# Altium schematic sheet 03_LEDs_0_4.SchDoc
size A
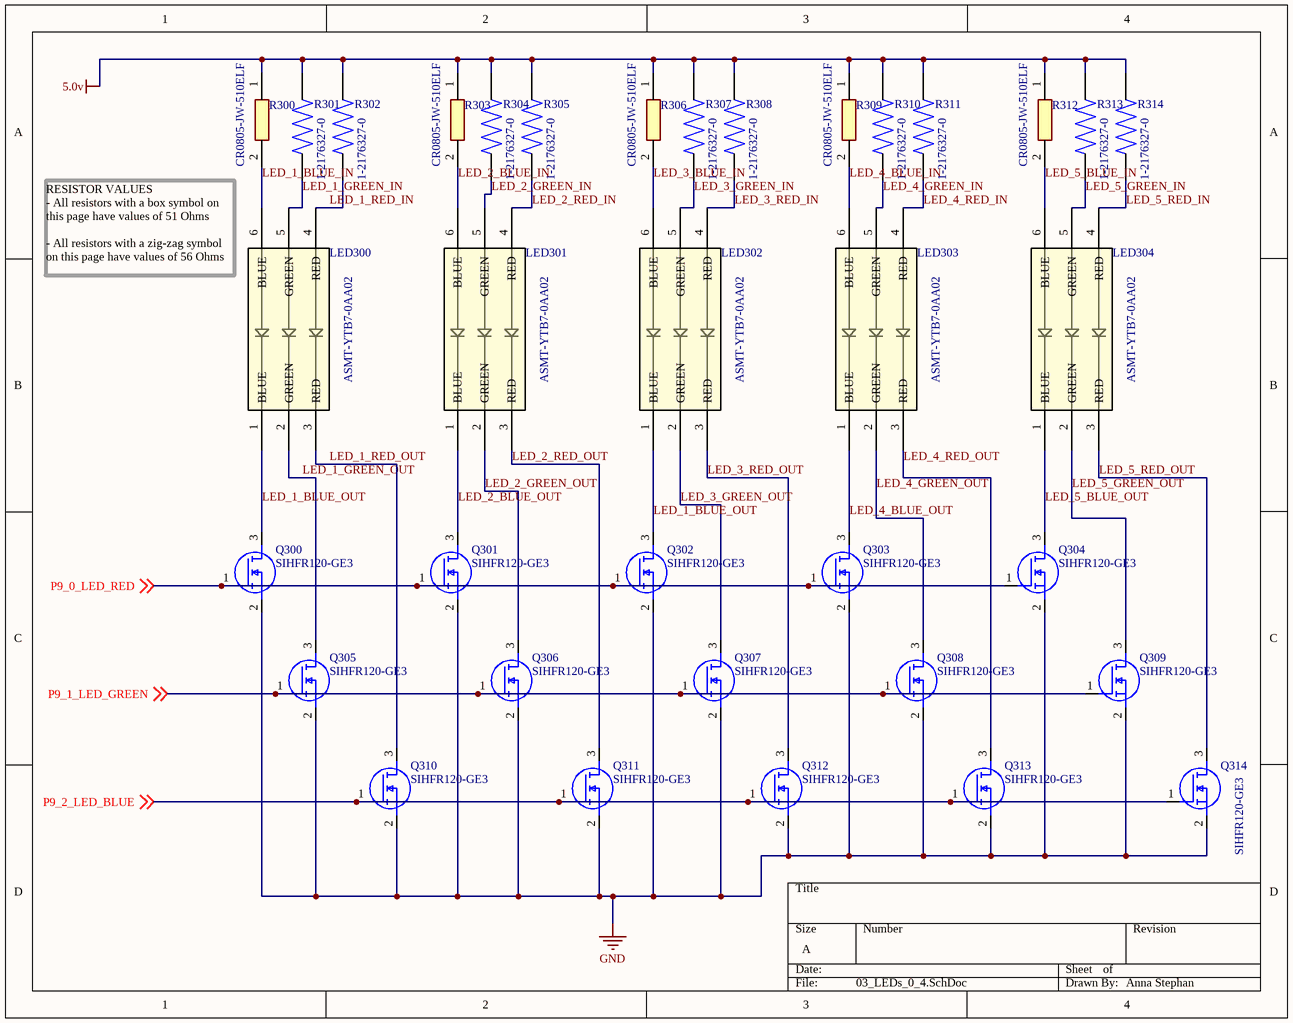
[diagram p0: 03_LEDs_0_4.SchDoc]

## Parts
LED300  ASMT-YTB7-0AA02  [LED_ASMT-YTD7-0AA02]
LED301  ASMT-YTB7-0AA02  [LED_ASMT-YTD7-0AA02]
LED302  ASMT-YTB7-0AA02  [LED_ASMT-YTD7-0AA02]
LED303  ASMT-YTB7-0AA02  [LED_ASMT-YTD7-0AA02]
LED304  ASMT-YTB7-0AA02  [LED_ASMT-YTD7-0AA02]
Q300  SIHFR120-GE3  [SIHFR120GE3]
Q301  SIHFR120-GE3  [SIHFR120GE3]
Q302  SIHFR120-GE3  [SIHFR120GE3]
Q303  SIHFR120-GE3  [SIHFR120GE3]
Q304  SIHFR120-GE3  [SIHFR120GE3]
Q305  SIHFR120-GE3  [SIHFR120GE3]
Q306  SIHFR120-GE3  [SIHFR120GE3]
Q307  SIHFR120-GE3  [SIHFR120GE3]
Q308  SIHFR120-GE3  [SIHFR120GE3]
Q309  SIHFR120-GE3  [SIHFR120GE3]
Q310  SIHFR120-GE3  [SIHFR120GE3]
Q311  SIHFR120-GE3  [SIHFR120GE3]
Q312  SIHFR120-GE3  [SIHFR120GE3]
Q313  SIHFR120-GE3  [SIHFR120GE3]
Q314  SIHFR120-GE3  [SIHFR120GE3]
R300  CR0805-JW-510ELF  [RESC2012X60N]
R301  1-2176327-0  [RESC2012X65N]
R302  1-2176327-0  [RESC2012X65N]
R303  CR0805-JW-510ELF  [RESC2012X60N]
R304  1-2176327-0  [RESC2012X65N]
R305  1-2176327-0  [RESC2012X65N]
R306  CR0805-JW-510ELF  [RESC2012X60N]
R307  1-2176327-0  [RESC2012X65N]
R308  1-2176327-0  [RESC2012X65N]
R309  CR0805-JW-510ELF  [RESC2012X60N]
R310  1-2176327-0  [RESC2012X65N]
R311  1-2176327-0  [RESC2012X65N]
R312  CR0805-JW-510ELF  [RESC2012X60N]
R313  1-2176327-0  [RESC2012X65N]
R314  1-2176327-0  [RESC2012X65N]

## Nets
5.0v: R300.1 R301.2 R302.2 R303.1 R304.2 R305.2 R306.1 R307.2 R308.2 R309.1 R310.2 R311.2 R312.1 R313.2 R314.2
GND: Q300.2(S) Q301.2(S) Q302.2(S) Q303.2(S) Q304.2(S) Q305.2(S) Q306.2(S) Q307.2(S) Q308.2(S) Q309.2(S) Q310.2(S) Q311.2(S) Q312.2(S) Q313.2(S) Q314.2(S)
LED_1_BLUE_IN: LED300.6(BLUE) R300.2
LED_1_BLUE_OUT: LED300.1(BLUE) LED302.1(BLUE) Q300.3(D) Q302.3(D)
LED_1_GREEN_IN: LED300.5(GREEN) R301.1
LED_1_GREEN_OUT: LED300.2(GREEN) Q305.3(D)
LED_1_RED_IN: LED300.4(RED) R302.1
LED_1_RED_OUT: LED300.3(RED) Q310.3(D)
LED_2_BLUE_IN: LED301.6(BLUE) R303.2
LED_2_BLUE_OUT: LED301.1(BLUE) Q301.3(D)
LED_2_GREEN_IN: LED301.5(GREEN) R304.1
LED_2_GREEN_OUT: LED301.2(GREEN) Q306.3(D)
LED_2_RED_IN: LED301.4(RED) R305.1
LED_2_RED_OUT: LED301.3(RED) Q311.3(D)
LED_3_BLUE_IN: LED302.6(BLUE) R306.2
LED_3_GREEN_IN: LED302.5(GREEN) R307.1
LED_3_GREEN_OUT: LED302.2(GREEN) Q307.3(D)
LED_3_RED_IN: LED302.4(RED) R308.1
LED_3_RED_OUT: LED302.3(RED) Q312.3(D)
LED_4_BLUE_IN: LED303.6(BLUE) R309.2
LED_4_BLUE_OUT: LED303.1(BLUE) Q303.3(D)
LED_4_GREEN_IN: LED303.5(GREEN) R310.1
LED_4_GREEN_OUT: LED303.2(GREEN) Q308.3(D)
LED_4_RED_IN: LED303.4(RED) R311.1
LED_4_RED_OUT: LED303.3(RED) Q313.3(D)
LED_5_BLUE_IN: LED304.6(BLUE) R312.2
LED_5_BLUE_OUT: LED304.1(BLUE) Q304.3(D)
LED_5_GREEN_IN: LED304.5(GREEN) R313.1
LED_5_GREEN_OUT: LED304.2(GREEN) Q309.3(D)
LED_5_RED_IN: LED304.4(RED) R314.1
LED_5_RED_OUT: LED304.3(RED) Q314.3(D)
P9_0_LED_RED: Q300.1(G) Q301.1(G) Q302.1(G) Q303.1(G) Q304.1(G) ; off-sheet P9_0_LED_RED
P9_1_LED_GREEN: Q305.1(G) Q306.1(G) Q307.1(G) Q308.1(G) Q309.1(G) ; off-sheet P9_1_LED_GREEN
P9_2_LED_BLUE: Q310.1(G) Q311.1(G) Q312.1(G) Q313.1(G) Q314.1(G) ; off-sheet P9_2_LED_BLUE

## Notes on the sheet
- (near LED300) RESISTOR VALUES
  - All resistors with a box symbol on this page have values of 51 Ohms
  - All resistors with a zig-zag symbol on this page have values of 56 Ohms
- Anna Stephan

## Library data of the parts
LED300-LED304 = ASMT-YTB7-0AA02: No Description Available; Mfr_Name: Broadcom; Type: DEV; Copyright: Copyright (C) 2022 Ultra Librarian. All rights reserved.; Manufacturer_Part_Number: ASMT-YTB7-0AA02; Digi-Key_Part_Number_1: ASMT-YTB7-0AA02-ND; Digi-Key_Part_Number_2: 516-3132-2-ND; Digi-Key_Part_Number_3: 516-3132-1-ND; Digi-Key_Part_Number_4: 516-3132-6-ND; RefDes: RefDes
Q300-Q314 = SIHFR120-GE3: MOSFET (N-Channel); Manufacturer_Name: Vishay; Datasheet Link: https://www.mouser.in/datasheet/2/427/91266-1768752.pdf; Height: 2.38mm; Manufacturer_Part_Number: SIHFR120-GE3
R300 R303 R306 R309 R312 = CR0805-JW-510ELF: Resistor; Manufacturer_Name: Bourns; Datasheet Link: https://www.bourns.com/pdfs/chpreztr.pdf; Height: 0.6mm; Manufacturer_Part_Number: CR0805-JW-510ELF
R301 R302 R304 R305 R307 R308 R310 R311 R313 R314 = 1-2176327-0: Fixed Resistor CRGP 0805 56R 1%; Package: None; Price: None; Value: *; MP: 1-2176327-0; Availability: Unavailable